# EAGLE design Adafruit MCP4725 QT (EAGLE 9.6.2)
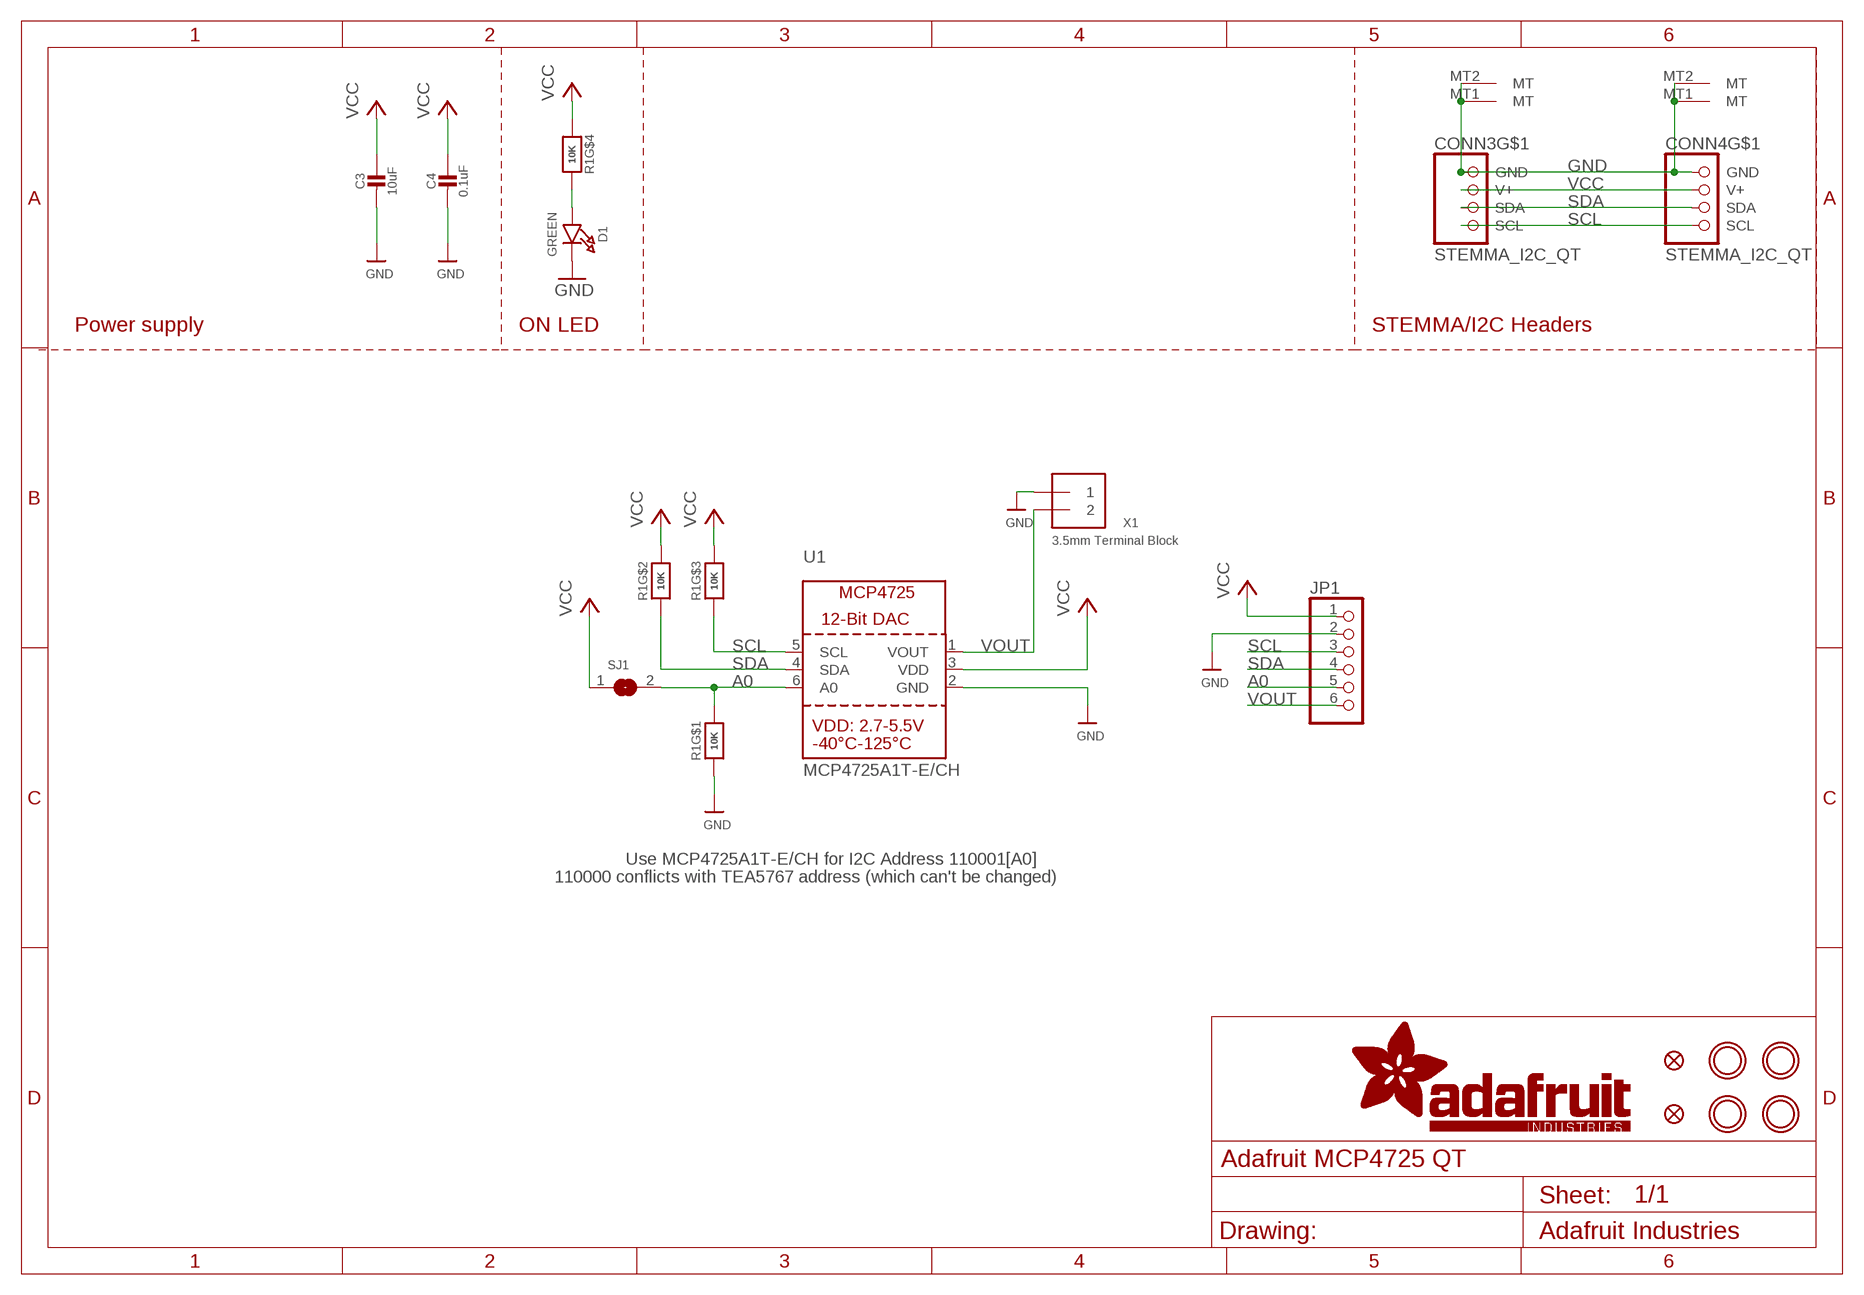
[diagram p0: schematic, sheet 1]

## Parts
C3  10uF  CAP_CERAMIC0805-NOOUTLINE  [0805-NO]
C4  0.1uF  CAP_CERAMIC0603_NO  [0603-NO]
CONN3  STEMMA_I2C_QT  [JST_SH4]
CONN4  STEMMA_I2C_QT  [JST_SH4]
D1  GREEN  LED0603_NOOUTLINE  [CHIPLED_0603_NOOUTLINE]
FID3  FIDUCIAL_1MM  [FIDUCIAL_1MM]
FID4  FIDUCIAL_1MM  [FIDUCIAL_1MM]
JP1  HEADER-1X670MIL  [1X06_ROUND_70]
R1  10K  RESISTOR_4PACK  [RESPACK_4X0603]
SJ1  SOLDERJUMPER  [SOLDERJUMPER_ARROW_NOPASTE]
U1  MCP4725A1T-E/CH  DAC_MCP4725  [SOT23-6]
U$20  MOUNTINGHOLE2.5  [MOUNTINGHOLE_2.5_PLATED]
U$21  MOUNTINGHOLE2.5  [MOUNTINGHOLE_2.5_PLATED]
U$25  MOUNTINGHOLE2.5  [MOUNTINGHOLE_2.5_PLATED]
U$27  MOUNTINGHOLE2.5  [MOUNTINGHOLE_2.5_PLATED]
X1  3.5mm Terminal Block  TERMBLOCK_1X2_3.5MM  [TERMBLOCK_1X2-3.5MM]

## Nets
A0: JP1.5 R1.8 SJ1.2 U1.6(A0)
GND: C3.2 C4.2 CONN3.1(GND) CONN3.MT1(MT) CONN3.MT2(MT) CONN4.1(GND) CONN4.MT1(MT) CONN4.MT2(MT) D1.C JP1.2 R1.1 U1.2(GND) X1.1
N$1: D1.A R1.5
SCL: CONN3.4(SCL) CONN4.4(SCL) JP1.3 R1.3 U1.5(SCL)
SDA: CONN3.3(SDA) CONN4.3(SDA) JP1.4 R1.2 U1.4(SDA)
VCC [highpower]: C3.1 C4.1 CONN3.2(V+) CONN4.2(V+) JP1.1 R1.4 R1.6 R1.7 SJ1.1 U1.3(VDD)
VOUT: JP1.6 U1.1(VOUT) X1.2

## Notes on the sheet
- Power supply | ON LED | STEMMA/I2C Headers
- Use MCP4725A1T-E/CH for I2C Address 110001[A0]
- 110000 conflicts with TEA5767 address (which can't be changed)

## Library data of the parts
C3 C4 = microbuilder:CAP_CERAMIC: Ceramic Capacitors For new designs, use the packages preceded by an '_' character since they are more reliable: The following footprints should be used on most boards: _0402 - Standard footprint for regular board layouts _0603 - Standard footprint for regular board layouts _0805 - Standard footprint for regular board layouts _1206 - Standard footprint for regular board layouts For extremely tight-pitch boards where space is at a premium, the following 'micro-pitch' footprints can be used (smaller pads, no silkscreen outline, etc.): _0402MP - Micro-pitch footprint for very dense/compact boards _0603MP - Micro-pitch footprint for very dense/compact boards _0805MP - Micro-pitch footprint for very dense/compact boards _1206MP - Micro-pitch footprint for very dense/compact boards
CONN3 CONN4 = microbuilder:STEMMA_I2C
D1 = microbuilder:LED: LED 0603 - 0603 Surface Mount Package 2mA: Green LED - Low Power (3.9mcd, 2ma, 1.7Vf) - Digikey: 475-2709-2-ND Orange LED - Low Power (9.8mcd, 2ma, 1.8Vf) - Digikey: 475-1194-2-ND Red LED - Low Power (5mcd, 2ma, 1.8Vf) - Digikey: 475-1195-2-ND Yellow LED - Low Power (7mcd, 2ma, 1.8Vf) - Digikey: 475-1196-2-ND 5mA: Blue LED - Low Power (17mcd, 5ma, 2.9Vf) - Digikey: LNJ937W8CRACT-ND 0805 - 0805 Surface Mount Package 2mA: Red LED (8.8mcd, 2mA, 1.8Vf, Clear) - Low Power [Digikey: 475-2510-1-ND] Green LED (5mcd, 2mA, 1.8Vf, Clear) - Low Power [Digikey: 475-2730-1-ND] Yellow LED (11.3mcd, 2mA, 1.8Vf, Clear) - Low Power [Digikey: 475-2555-1-ND] 20mA: Red LED (104mcd, 20mA, Diffused) - LS R976 [Digikey: 475-1278-6-ND] Red LED (12mcd, 20mA, 2.0Vf, Clear) - APT2012EC [Digikey: 754-1128-1-ND] Green LED (15mcd, 20mA, 2.2Vf, Clear) - APT2012GC [Digikey: 754-1131-1-ND] Orange LED (160mcd, 20mA, 2.1Vf, Clear) - APT2012SECK [Digikey: 754-1130-1-ND] 1206 - 1206 Surface Mount Package Green LED (26mcd, 20mA, Diffused) - LG N971 [Digikey: 475-1407-6-ND] Red LED (15mcd, 20mA, Diffused) - LH N974 [Digikey: 475-1416-6-ND] Cree - Cree High-Power Surface Mount LEDs XPEBWT-L1-0000-00D50 - White 111lm 350mA 2.9Vf 6200K 110° XTEAWT-00-0000-00000LEE3 - White 114lm 350mA 2.85Vf 5000K 115° Everlight - Everlight 45-21 Series Surface Mount LEDs 45-21/QK2C-B2832AC2CB2/2T - Warm White 2000mcd 20mA 3.25Vf 3050K 120° 45-21/LK2C-B38452C4CB2/2T - Nuetral White 2000mcd 20mA 3.25Vf 4150K 120° 45-21/LK2C-B50634C6CB2/2T - Cold White 2200mcd 20mA 3.25Vf 5650K 120° PLCC2 Reverse Mount LS T77K-J1L2-1-0-2-R18-Z - Red 11.25mcd 2mA 1.8Vf 630nm 120° LO T77K-L1M2-24-Z - Orange 19.6mcd 2mA 1.8Vf 606nm 120° LY T77K-K2M1-26-Z - Yellow 15.7mcd 2mA 1.8Vf 587nm 120°
FID3 FID4 = microbuilder:FIDUCIAL: Fiducial Alignment Points Various fiducial points for machine vision alignment.; BOM: EXCLUDE
JP1 = microbuilder:HEADER-1X6: PIN HEADER
R1 = microbuilder:RESISTOR_4PACK: Resistor Packs (4 resistors) 4 x 0603 10K 1/16W - Digikey: YC164J-10KCT-ND
SJ1 = microbuilder:SOLDERJUMPER: SMD Solder JUMPER Solder the two pads together to create a connection, or remove the solder to break it. REFLOW - Use this footprint for solder paste and reflow ovens. WAVE - Use this footprint for hand-soldering (larger pads). CLOSED - Has a trace between the two pads to ensure it is closed by default. The trace needs to be cut to disable the jumper, and can be closed again by creating a solder bridge between the two pads.; BOM: EXCLUDE
U1 = microbuilder:DAC_MCP4725: MCP4725 - 12-Bit I2C DAC with on-board EEPROM Settling Time: 6 µs 2.7-5.5V Supply 100kHz, 400kHz, 3.4 Mbps I²C EEPROM can be used to store a specific output voltage which will be set coming out of reset I²C Address: 1100 A2 A1 A0 A0 is set via the A0 pin, A2 and A1 are hard-wired on the chip depending on the model chosen: Part Number A2 A1 Code MCP4725A0T-E/CH 0 0 AJNN MCP4725A1T-E/CH 0 1 APNN MCP4725A2T-E/CH 1 0 AQNN MCP4725A3T-E/CH 1 1 ARNN
U$20 U$21 U$25 U$27 = adafruit_electromech:MOUNTINGHOLE: Mounting Hole For #2 screws (0.086"/2.18mm width, 0.094"/2.4mm hole) use 2.5mm; BOM: EXCLUDE
X1 = adafruit_electromech:TERMBLOCK_1X2: 3.5mm Terminal block http://www.ladyada.net/library/pcb/eaglelibrary.html

## Net classes
1 highpower: width 0.305 mm, drill 0.483 mm
2 lowpower: width 0.254 mm, drill 0.483 mm

## Board
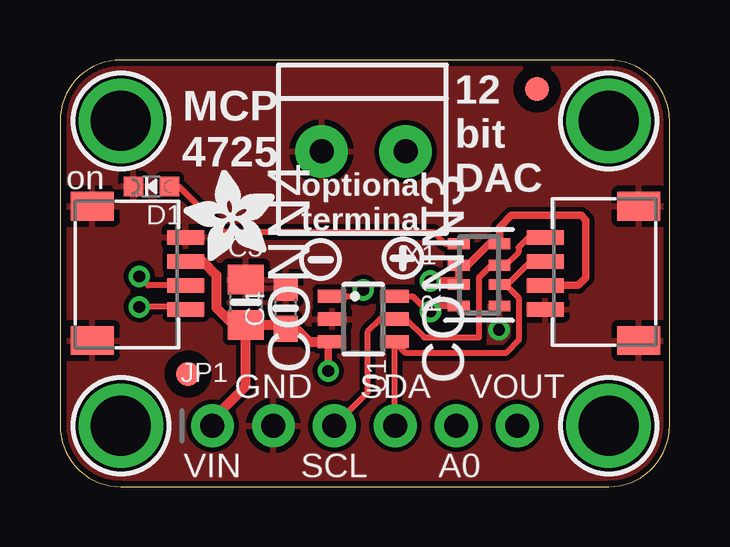
[diagram p1: board, top side]
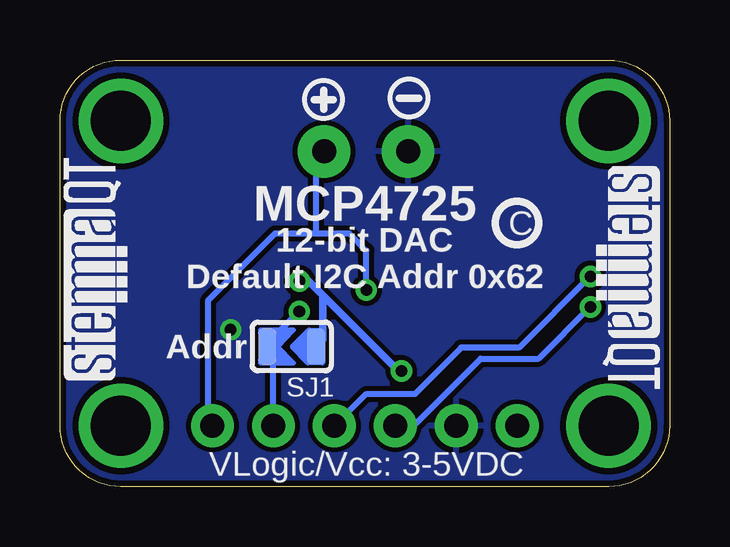
[diagram p2: board, bottom side, seen from below]

Size 25.4 x 17.78 mm. Coordinates in mm from the lower left corner, seen from the top.
Outline: 0,15.24 0,2.54 arc90 2.54,0 22.86,0 arc90 25.4,2.54 25.4,15.24 arc90 22.86,17.78 2.54,17.78 arc90 0,15.24
Copper layers (1*16): Top 0.035mm / dielectric 1.5mm / Bottom 0.035mm
Design rules "adafruit 8-8": minimum track width 6mil, minimum drill 15.5mil, track to track 8mil, track to pad 8mil, pad to pad 8mil, via to via 8mil, smd to smd 8mil, copper to edge 10mil, drill to drill 8mil, minimum pad ring 10mil, minimum via ring 8mil, stop-mask expansion 2mil, vias tented up to drill 20mil, thermal gap 10mil

### Footprints (pad centres in the part's own frame; a part is rotated, then mirrored left to right if it is on the bottom)
0805-NO = smd 1.24 x 1.5: 1 -0.95,0; 2 0.95,0
0603-NO = smd 1.075 x 1: 1 -0.85,0; 2 0.85,0
JST_SH4 = smd 0.6 x 1.55: 1 -1.5,2.514; 2 -0.5,2.514; 3 0.5,2.514; 4 1.5,2.514 | smd 1.2 x 1.8: MT1 -2.8,-1.386; MT2 2.8,-1.386
CHIPLED_0603_NOOUTLINE = smd 0.8 x 0.8: A 0,-0.75; C 0,0.75
FIDUCIAL_1MM = smd 1 x 1: 1 0,0
1X06_ROUND_70 = drill 1 pad 1.778: 1 -6.35,0; 2 -3.81,0; 3 -1.27,0; 4 1.27,0; 5 3.81,0; 6 6.35,0
RESPACK_4X0603 = smd 0.45 x 0.9: 1 -1.3,-0.85; 2 -0.4,-0.85; 3 0.4,-0.85; 4 1.3,-0.85; 5 1.3,0.85; 6 0.4,0.85; 7 -0.4,0.85; 8 -1.3,0.85
SOLDERJUMPER_ARROW_NOPASTE = smd 0.762 x 1.524: 1 -1.016,0; 2 1.016,0
SOT23-6 = smd 0.55 x 1.2: 1 -0.95,-1.3; 2 0,-1.3; 3 0.95,-1.3; 4 0.95,1.3; 5 0,1.3; 6 -0.95,1.3
MOUNTINGHOLE_2.5_PLATED = drill 2.5 pad 3.2: P$1 0,0
TERMBLOCK_1X2-3.5MM = drill 1 pad 2.184: 1 1.8,0; 2 -1.7,0

### Placement (x,y rotation side)
C3  7.75,7.68 90 top
C4  9.4,7.43 90 top
CONN3  22.73,8.89 90 top
CONN4  2.73,8.89 270 top
D1  3.81,12.51 90 top
FID3  5.33,4.7 0 top
FID4  19.88,16.57 0 top
JP1  12.7,2.54 0 top
R1  17.46,8.83 90 top
SJ1  15.75,5.84 180 bottom
U1  12.64,6.99 270 top
U$2  [SYMBOL_PLUS]  14.29,9.53 0 top
U$4  [SYMBOL_MINUS]  10.86,9.46 0 top
U$5  [SYMBOL_MINUS]  10.86,16.19 0 bottom
U$7  [SYMBOL_PLUS]  14.41,16.13 0 bottom
U$8  [PCBFEAT-REV-040]  6.35,10.99 0 bottom
U$20  2.54,15.24 0 top
U$21  22.86,15.24 0 top
U$25  2.54,2.54 0 top
U$27  22.86,2.54 0 top
U$29  [ADAFRUIT_3.5MM]  8.95,9.4 90 top
U$31  [STEMMAQT]  22.61,4.45 90 bottom
U$32  [STEMMAQT]  3.05,13.34 270 bottom
X1  12.7,13.97 180 top

### Tracks (layer width: path | path; a pad name or v marks a point on that pad's centre or on a via)
A0  (via drill 0.48)
  Top 0.254: R1.8 15.65,7.53 v15.43,7.3 15.33,7.3 14.7,7.93 U1.6
  Bottom 0.254: JP1.5 16.51,5.59 16.64,5.71 | 16.64,5.71 SJ1.2 | v15.43,7.3 16.64,6.1 16.64,5.71
GND  (via drill 0.48)
  other vias: 18.29,6.54
  pour Top: 0,17.78 25.4,17.78 25.4,0 0,0
  pour Bottom: 0,17.78 25.4,17.78 25.4,0 0,0
N$1
  Top 0.254: D1.A 4.94,12.51 6.85,10.6 15.56,10.6 16.04,10.13 R1.5
SCL  (via drill 0.48)
  Top 0.254: JP1.3 12.83,3.94 12.83,6.48 13.34,6.99 U1.5 14.41,6.99 15.18,6.22 17.46,6.22 17.46,8.72 17.97,9.23 R1.3 18.56,9.23 19.11,9.78 19.11,9.97 19.53,10.39 CONN3.4 | CONN4.4 5.14,7.49 v3.3,7.49
  Bottom 0.254: v3.3,7.49 5.46,5.33 7.87,5.33 10.67,2.54 JP1.3
SDA  (via drill 0.48)
  Top 0.254: JP1.4 13.94,2.57 U1.4 14.38,5.59 18.61,5.59 19.11,6.1 19.11,7.87 18.55,8.43 R1.2 18.65,8.43 19.62,9.39 CONN3.3 | CONN4.3 3.67,8.39 v3.3,8.76
  Bottom 0.254: v3.3,8.76 6.27,5.79 8.69,5.79 10.6,3.87 12.64,3.87 JP1.4
VCC  (via drill 0.48)
  Top 0.305: U1.3 11.18,5.88 v11.18,4.83 | v15.43,8.57 16.47,8.57 R1.7 R1.6 16.99,9.23 17.91,10.14 17.91,10.06 18.25,10.06 R1.4 18.31,10.82 18.8,11.3 21.72,11.3 21.91,11.11 21.91,8.7 21.6,8.39 CONN3.2
  Top 0.406: JP1.1 6.35,2.79 7.75,4.19 C3.1 | C3.1 7.24,6.73 6.51,7.46 6.51,8.82 5.94,9.39 CONN4.2 | C3.1 9.24,6.73 C4.1 9.84,6.58 10.38,6.04 U1.3
  Bottom 0.305: v15.43,8.57 15.05,8.57 14.45,7.97 | 14.45,7.97 11.24,4.76 v11.18,4.83 | SJ1.1 14.45,6.13 14.45,7.97
VOUT  (via drill 0.48)
  Top 0.254: v12.64,8.19 12.38,7.93 U1.1
  Bottom 0.254: v12.64,8.19 12.64,9.84 13.34,10.54 14.73,10.54 | 14.73,10.54 16.45,10.54 19.24,7.75 19.24,2.73 JP1.6 | 14.73,10.54 14.73,14.18 X1.2

### Text on the board
tPlace: MCP / 4725 | 12 / bit / DAC | on | optional / terminal | GND | SDA | VOUT | VIN | SCL | A0
bPlace: MCP4725 | 12-bit DAC / Default I2C Addr 0x62 | Addr | VLogic/Vcc: 3-5VDC